# EAGLE design 7SegClock (EAGLE 7.4.0)
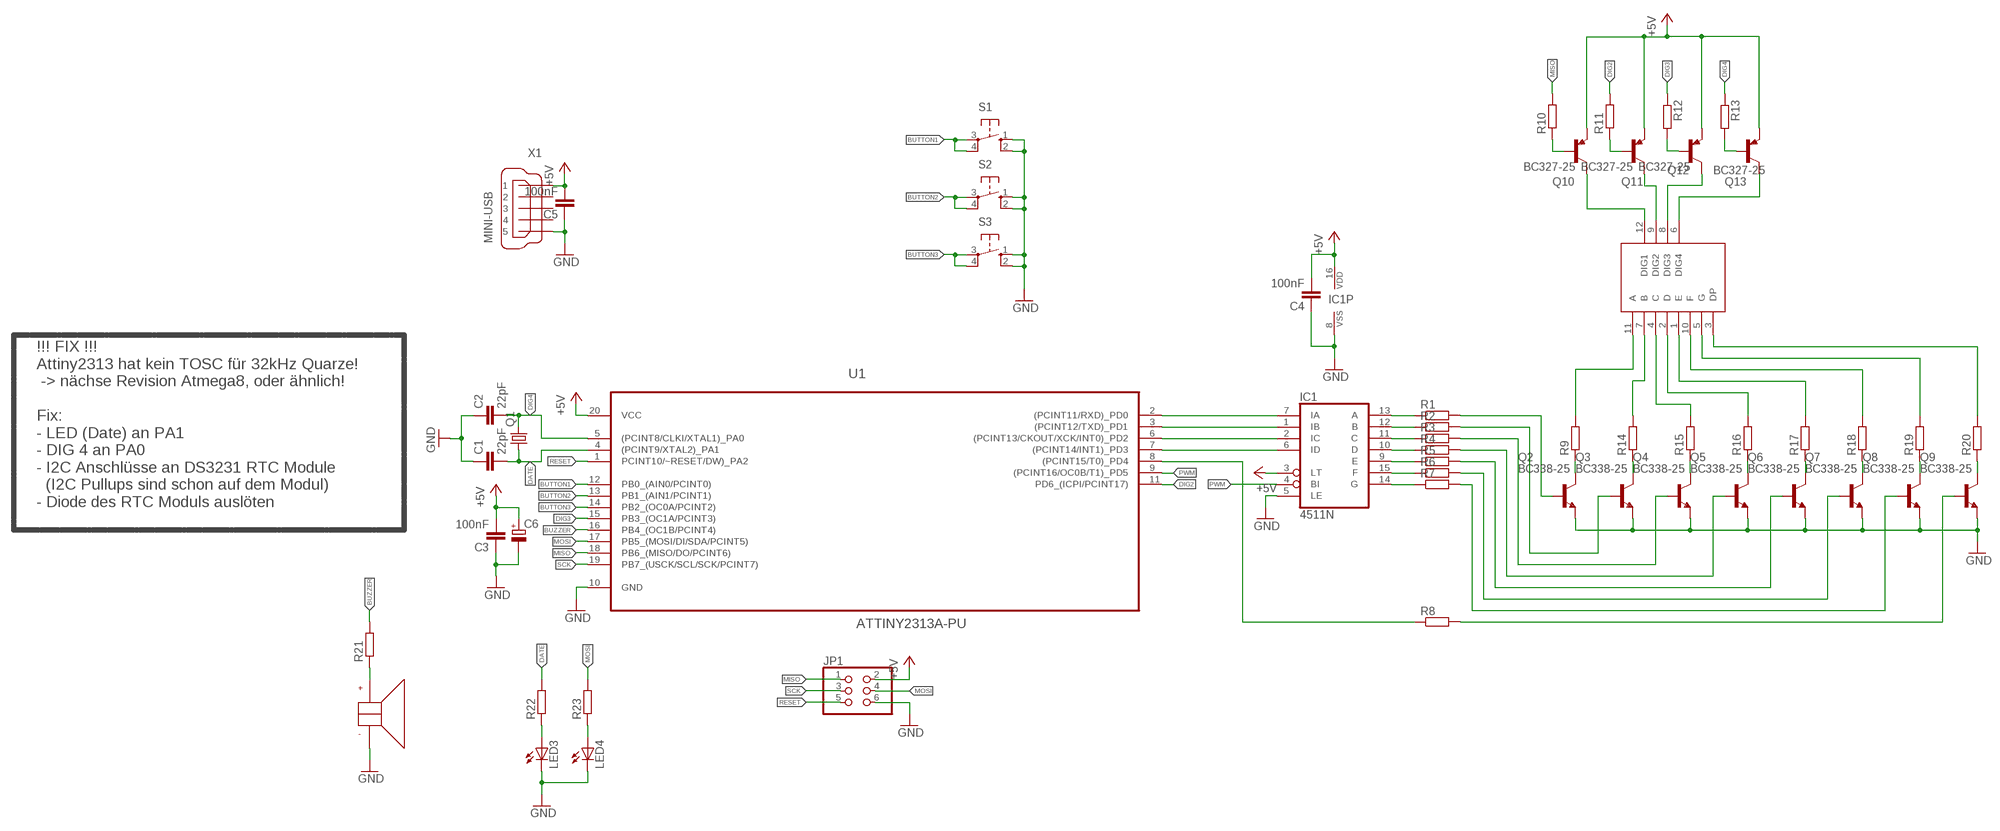
[diagram p0: schematic, sheet 1]

## Parts
C1  22pF  C-EU025-025X050  [C025-025X050]
C2  22pF  C-EU025-025X050  [C025-025X050]
C3  100nF  C-EU025-025X050  [C025-025X050]
C4  100nF  C-EU025-025X050  [C025-025X050]
C5  100nF  C-EU025-025X050  [C025-025X050]
C6  CPOL-EUE2-5  [E2-5]
IC1  4511N  [DIL16]
JP1  PINHD-2X3  [2X03]
LED1  7SEGCOMAN  [7SEGCOMAN]
LED3  LED3MM  [LED3MM]
LED4  LED3MM  [LED3MM]
Q1  CRYSTALTC38H  [TC38H]
Q2  BC338-25  [TO92-EBC]
Q3  BC338-25  [TO92-EBC]
Q4  BC338-25  [TO92-EBC]
Q5  BC338-25  [TO92-EBC]
Q6  BC338-25  [TO92-EBC]
Q7  BC338-25  [TO92-EBC]
Q8  BC338-25  [TO92-EBC]
Q9  BC338-25  [TO92-EBC]
Q10  BC327-25  [TO92-EBC]
Q11  BC327-25  [TO92-EBC]
Q12  BC327-25  [TO92-EBC]
Q13  BC327-25  [TO92-EBC]
R1  R-EU_0207/7  [0207/7]
R2  R-EU_0207/7  [0207/7]
R3  R-EU_0207/7  [0207/7]
R4  R-EU_0207/7  [0207/7]
R5  R-EU_0207/7  [0207/7]
R6  R-EU_0207/7  [0207/7]
R7  R-EU_0207/7  [0207/7]
R8  R-EU_0207/7  [0207/7]
R9  R-EU_0207/7  [0207/7]
R10  R-EU_0207/7  [0207/7]
R11  R-EU_0207/7  [0207/7]
R12  R-EU_0207/7  [0207/7]
R13  R-EU_0207/7  [0207/7]
R14  R-EU_0207/7  [0207/7]
R15  R-EU_0207/7  [0207/7]
R16  R-EU_0207/7  [0207/7]
R17  R-EU_0207/7  [0207/7]
R18  R-EU_0207/7  [0207/7]
R19  R-EU_0207/7  [0207/7]
R20  R-EU_0207/7  [0207/7]
R21  R-EU_0207/7  [0207/7]
R22  R-EU_0207/7  [0207/7]
R23  R-EU_0207/7  [0207/7]
S1  10-XX  [B3F-10XX]
S2  10-XX  [B3F-10XX]
S3  10-XX  [B3F-10XX]
U1  ATTINY2313A-PU  [DIP254P762X533-20]
U$1  PIEZO_BUZZER_RM7,6  [PIEZO_BUZZER_RM7,6]
X1  MINI-USB  MINI-USB-32005-201  [32005-201]

## Nets
+5V: C3.2 C4.2 C5.2 C6.+ IC1.3(LT) IC1.16(VDD) JP1.2 Q10.E Q11.E Q12.E Q13.E U1.20(VCC) X1.1
BUTTON1: S1.3(P) S1.4(P1) U1.12(PB0_(AIN0/PCINT0))
BUTTON2: S2.3(P) S2.4(P1) U1.13(PB1_(AIN1/PCINT1))
BUTTON3: S3.3(P) S3.4(P1) U1.14(PB2_(OC0A/PCINT2))
BUZZER: R21.2 U1.16(PB4_(OC1B/PCINT4))
DATE: C1.2 Q1.1 R22.2 U1.4((PCINT9/XTAL2)_PA1)
DIG2: R11.2 U1.11(PD6_(ICPI/PCINT17))
DIG3: R12.1 U1.15(PB3_(OC1A/PCINT3))
DIG4: C2.2 Q1.2 R13.1 U1.5((PCINT8/CLKI/XTAL1)_PA0)
GND: C1.1 C2.1 C3.1 C4.1 C5.1 C6.- IC1.5(LE) IC1.8(VSS) JP1.6 LED3.K(C) LED4.K(C) Q2.E Q3.E Q4.E Q5.E Q6.E Q7.E Q8.E Q9.E S1.1(S) S1.2(S1) S2.1(S) S2.2(S1) S3.1(S) S3.2(S1) U1.10(GND) U$1.P$2 X1.5
MISO: JP1.1 R10.2 U1.18(PB6_(MISO/DO/PCINT6))
MOSI: JP1.4 R23.2 U1.17(PB5_(MOSI/DI/SDA/PCINT5))
N$3: Q2.B R1.2
N$4: Q3.B R2.2
N$5: Q4.B R3.2
N$6: Q5.B R4.2
N$7: Q6.B R5.2
N$8: Q7.B R6.2
N$9: Q8.B R7.2
N$10: IC1.7(IA) U1.2((PCINT11/RXD)_PD0)
N$11: IC1.1(IB) U1.3((PCINT12/TXD)_PD1)
N$12: IC1.2(IC) U1.6((PCINT13/CKOUT/XCK/INT0)_PD2)
N$13: IC1.6(ID) U1.7((PCINT14/INT1)_PD3)
N$14: Q9.B R8.2
N$15: R8.1 U1.8((PCINT15/T0)_PD4)
N$16: IC1.14(G) R7.1
N$17: IC1.15(F) R6.1
N$18: IC1.9(E) R5.1
N$19: IC1.10(D) R4.1
N$20: IC1.11(C) R3.1
N$21: IC1.12(B) R2.1
N$22: IC1.13(A) R1.1
N$23: LED1.11(A) R9.2
N$24: LED1.7(B) R14.2
N$25: LED1.4(C) R15.2
N$26: LED1.2(D) R16.2
N$27: LED1.1(E) R17.2
N$28: LED1.10(F) R18.2
N$29: LED1.5(G) R19.2
N$30: LED1.3(DP) R20.2
N$32: R21.1 U$1.P$1
N$34: LED3.A R22.1
N$35: LED1.12(DIG1) Q10.C
N$36: LED1.9(DIG2) Q11.C
N$37: LED1.8(DIG3) Q12.C
N$38: LED1.6(DIG4) Q13.C
N$39: Q10.B R10.1
N$40: Q11.B R11.1
N$41: Q12.B R12.2
N$42: Q13.B R13.2
N$43: Q2.C R9.1
N$44: Q3.C R14.1
N$45: Q4.C R15.1
N$46: Q5.C R16.1
N$47: Q6.C R17.1
N$48: Q7.C R18.1
N$49: Q8.C R19.1
N$50: Q9.C R20.1
N$51: LED4.A R23.1
PWM: IC1.4(BI) U1.9((PCINT16/OC0B/T1)_PD5)
RESET: JP1.5 U1.1(PCINT10/~RESET/DW)_PA2)
SCK: JP1.3 U1.19(PB7_(USCK/SCL/SCK/PCINT7))
Unconnected: X1.2 X1.3 X1.4

## Notes on the sheet
- !!! FIX !!!
  Attiny2313 hat kein TOSC für 32kHz Quarze!
   -> nächse Revision Atmega8, oder ähnlich!
  
  Fix:
  - LED (Date) an PA1
  - DIG 4 an PA0
  - I2C Anschlüsse an DS3231 RTC Module 
    (I2C Pullups sind schon auf dem Modul)
  - Diode des RTC Moduls auslöten

## Library data of the parts
C1-C5 = rcl:C-EU: CAPACITOR, European symbol
C6 = rcl:CPOL-EU: POLARIZED CAPACITOR, European symbol
IC1 = 45xx:4511: BCD to 7-segment LATCH/DECODER/DRIVER
JP1 = pinhead:PINHD-2X3: PIN HEADER
LED1 = TM-misc:7SEGCOMAN: 7 Segment Anzeige Common Anode - HDSP-B04E
LED3 LED4 = led:LED: LED OSRAM: - CHIPLED LG R971, LG N971, LY N971, LG Q971, LY Q971, LO R971, LY R971 LH N974, LH R974 LS Q976, LO Q976, LY Q976 LO Q996 - Hyper CHIPLED LW Q18S LB Q993, LB Q99A, LB R99A - SideLED LS A670, LO A670, LY A670, LG A670, LP A670 LB A673, LV A673, LT A673, LW A673 LH A674 LY A675 LS A676, LA A676, LO A676, LY A676, LW A676 LS A679, LY A679, LG A679 - Hyper Micro SIDELED® LS Y876, LA Y876, LO Y876, LY Y876 LT Y87S - SmartLED LW L88C, LW L88S LB L89C, LB L89S, LG L890 LS L89K, LO L89K, LY L89K LS L896, LA L896, LO L896, LY L896 - TOPLED LS T670, LO T670, LY T670, LG T670, LP T670 LSG T670, LSP T670, LSY T670, LOP T670, LYG T670 LG T671, LOG T671, LSG T671 LB T673, LV T673, LT T673, LW T673 LH T674 LS T676, LA T676, LO T676, LY T676, LB T676, LH T676, LSB T676, LW T676 LB T67C, LV T67C, LT T67C, LS T67K, LO T67K, LY T67K, LW E67C LS E67B, LA E67B, LO E67B, LY E67B, LB E67C, LV E67C, LT E67C LW T67C LS T679, LY T679, LG T679 LS T770, LO T770, LY T770, LG T770, LP T770 LB T773, LV T773, LT T773, LW T773 LH T774 LS E675, LA E675, LY E675, LS T675 LS T776, LA T776, LO T776, LY T776, LB T776 LHGB T686 LT T68C, LB T68C - Hyper Mini TOPLED® LB M676 - Mini TOPLED Santana® LG M470 LS M47K, LO M47K, LY M47K Source: http://www.osram.convergy.de LUXEON: - LUMILED® LXK2-PW12-R00, LXK2-PW12-S00, LXK2-PW14-U00, LXK2-PW14-V00 LXK2-PM12-R00, LXK2-PM12-S00, LXK2-PM14-U00 LXK2-PE12-Q00, LXK2-PE12-R00, LXK2-PE12-S00, LXK2-PE14-T00, LXK2-PE14-U00 LXK2-PB12-K00, LXK2-PB12-L00, LXK2-PB12-M00, LXK2-PB14-N00, LXK2-PB14-P00, LXK2-PB14-Q00 LXK2-PR12-L00, LXK2-PR12-M00, LXK2-PR14-Q00, LXK2-PR14-R00 LXK2-PD12-Q00, LXK2-PD12-R00, LXK2-PD12-S00 LXK2-PH12-R00, LXK2-PH12-S00 LXK2-PL12-P00, LXK2-PL12-Q00, LXK2-PL12-R00 Source: www.luxeon.com KINGBRIGHT: KA-3528ASYC Source: www.kingbright.com
Q1 = crystal:CRYSTAL: CRYSTAL; OC_FARNELL: unknown; OC_NEWARK: unknown
Q2-Q9 = transistor-npn:BC338*: NPN Transistor
Q10-Q13 = transistor-pnp:BC327*: PNP Transistror
R1-R23 = rcl:R-EU_: RESISTOR, European symbol
S1-S3 = switch-omron:10-XX: OMRON SWITCH; MPN: B3F-1000; OC_FARNELL: 176432; OC_NEWARK: 36M3542
U1 = AtmelMC:ATTINY2313A-PU: 8-bit Microcontroller; DESCRIPTION: 8-bit Microcontroller; MPN: ATTINY2313A-PU; OC_FARNELL: 1841616; OC_NEWARK: 12T1333; PACKAGE: DIP-20; SUPPLIER: Atmel
U$1 = TM-misc:PIEZO_BUZZER_RM7,6
X1 = con-cypressindustries:MINI-USB-: MINI USB-B Conector Source: www.cypressindustries.com; OC_FARNELL: unknown; OC_NEWARK: unknown

## Board
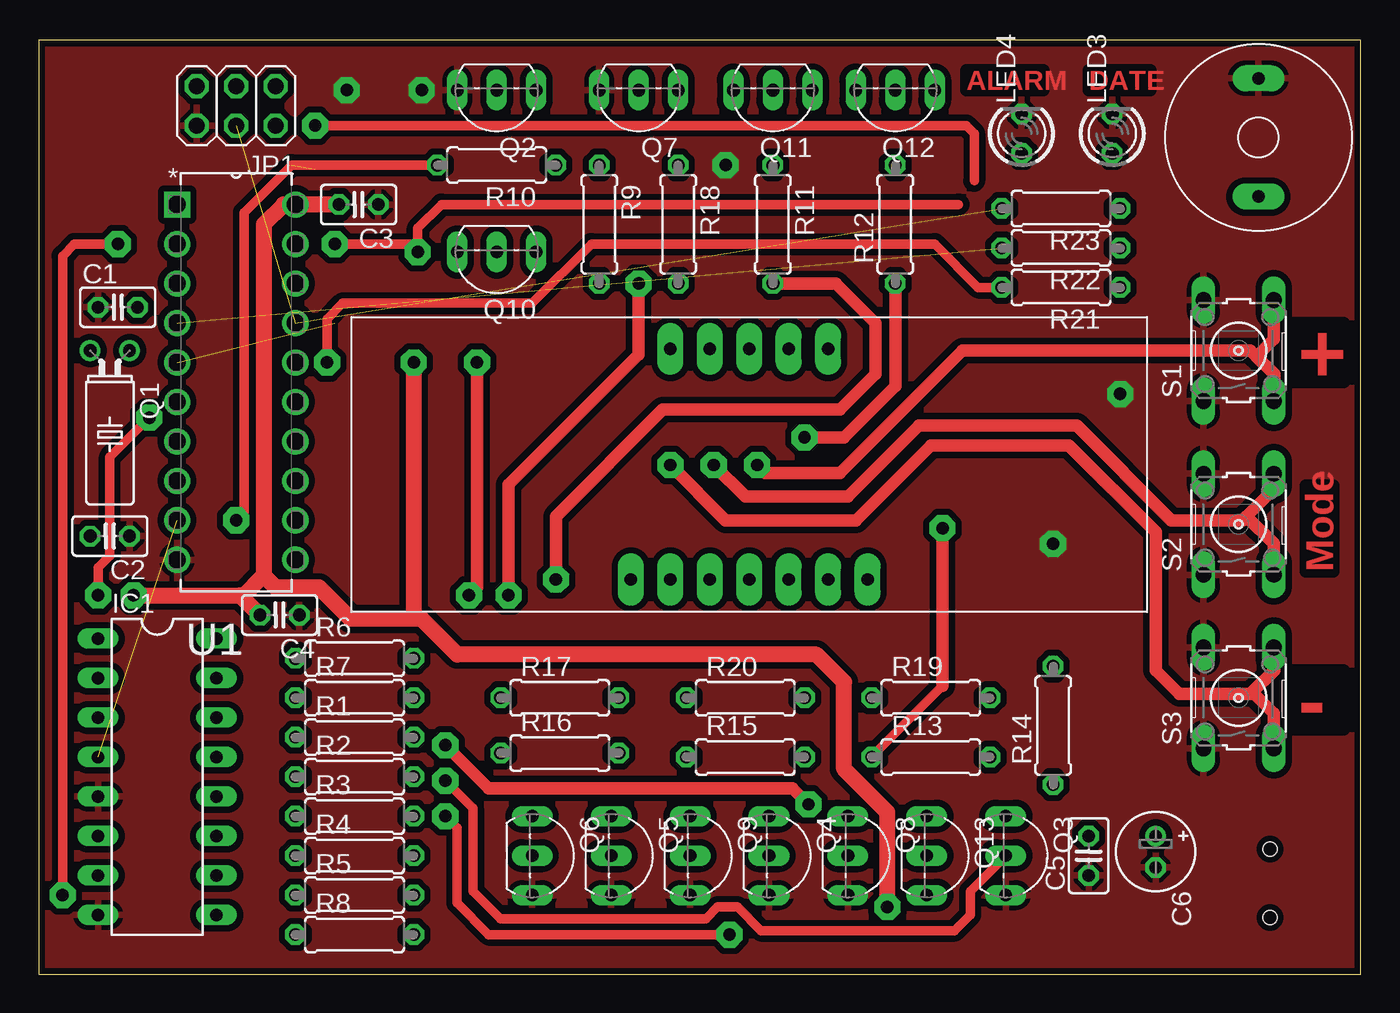
[diagram p1: board, top side]
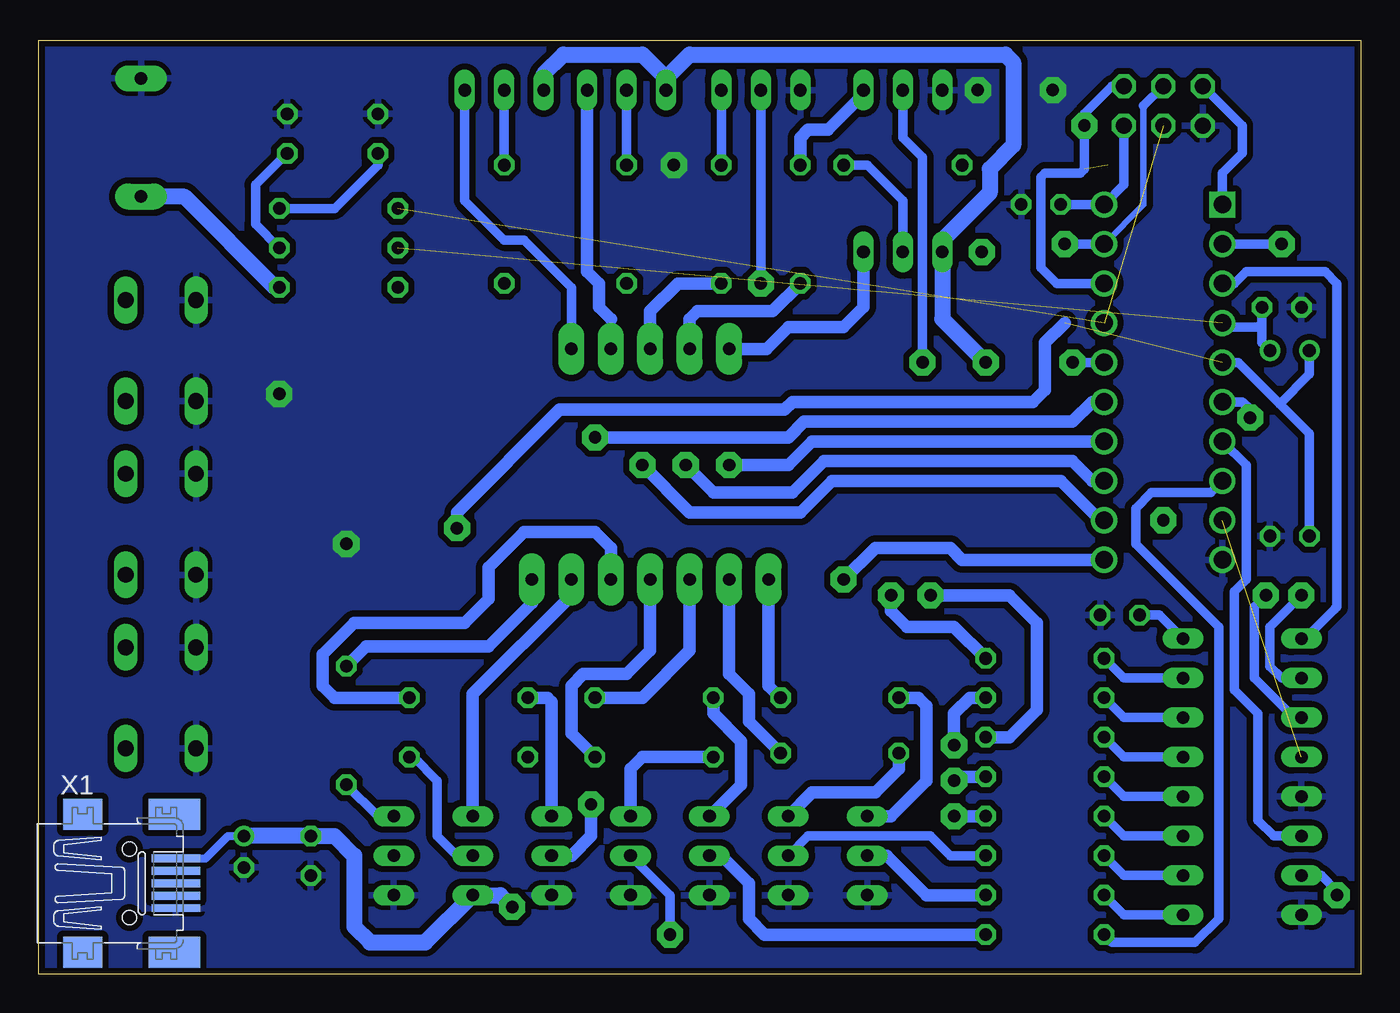
[diagram p2: board, bottom side, seen from below]

Size 85.07 x 60.12 mm. Coordinates in mm from the lower left corner, seen from the top.
Outline: 0,0 85.07,0 85.07,60.12 0,60.12 0,0
Copper layers (1*16): Top 0.035mm / dielectric 1.5mm / Bottom 0.035mm
Design rules "LoetLab": minimum track width 10mil, minimum drill 24mil, track to track 12mil, track to pad 12mil, pad to pad 12mil, via to via 12mil, smd to smd 10mil, copper to edge 12mil, drill to drill 12mil, minimum pad ring 10mil, minimum via ring 10mil, stop-mask expansion 4mil, vias tented up to drill 0mil, thermal gap 12mil

### Footprints (pad centres in the part's own frame; a part is rotated, then mirrored left to right if it is on the bottom)
C025-025X050 = drill 0.813 octagon: 1 -1.27,0; 2 1.27,0
E2-5 = drill 0.813 pad 1.27: + -1.016,0 | drill 0.813 pad 1.27 octagon: - 1.016,0
DIL16 = drill 0.813 long: 1 -8.89,-3.81; 2 -6.35,-3.81; 3 -3.81,-3.81; 4 -1.27,-3.81; 5 1.27,-3.81; 6 3.81,-3.81; 7 6.35,-3.81; 8 8.89,-3.81; 9 8.89,3.81; 10 6.35,3.81; 11 3.81,3.81; 12 1.27,3.81; 13 -1.27,3.81; 14 -3.81,3.81; 15 -6.35,3.81; 16 -8.89,3.81
2X03 = drill 1.016 octagon: 1 -2.54,-1.27; 2 -2.54,1.27; 3 0,-1.27; 4 0,1.27; 5 2.54,-1.27; 6 2.54,1.27
7SEGCOMAN = drill 0.8 pad 1.676 long: 1 -7.62,0; 2 -5.08,0; 3 -2.54,0; 4 0,0; 5 2.54,0; 6 5.08,0; 7 7.62,0; 8 5.08,14.84; 9 2.54,14.84; 10 0,14.84; 11 -2.54,14.84; 12 -5.08,14.84
LED3MM = drill 0.813 octagon: A -1.27,0; K 1.27,0
TC38H = drill 0.813: 1 -1.27,0; 2 1.27,0
TO92-EBC = drill 0.813 long: B 0,-1.27; C -2.54,-1.27; E 2.54,-1.27
0207/7 = drill 0.813 octagon: 1 -3.81,0; 2 3.81,0
B3F-10XX = drill 1.016 long: 1 -3.251,2.261; 2 3.251,2.261; 3 -3.251,-2.261; 4 3.251,-2.261
DIP254P762X533-20 = drill 1.118 square: 1 -7.62,22.86 | drill 1.118: 2 -7.62,20.32; 3 -7.62,17.78; 4 -7.62,15.24; 5 -7.62,12.7; 6 -7.62,10.16; 7 -7.62,7.62; 8 -7.62,5.08; 9 -7.62,2.54; 10 -7.62,0; 11 0,0; 12 0,2.54; 13 0,5.08; 14 0,7.62; 15 0,10.16; 16 0,12.7; 17 0,15.24; 18 0,17.78; 19 0,20.32; 20 0,22.86
PIEZO_BUZZER_RM7,6 = drill 0.8 pad 1.676 long: P$1 -3.8,0; P$2 3.8,0
32005-201 = smd 3.1 x 0.5: 1 3,1.6; 2 3,0.8; 3 3,0; 4 3,-0.8; 5 3,-1.6 | smd 2.5 x 2: M1 -3,-4.45; M2 -3,4.45 | smd 3.3 x 2: M3 2.9,4.45; M4 2.9,-4.45 | hole 0.9: 0,2.2; 0,-2.2

### Placement (x,y rotation side)
C1  5.08,42.93 0 top
C2  4.57,28.19 180 top
C3  20.57,49.53 180 top
C4  15.49,23.11 180 top
C5  67.56,7.62 90 top
C6  71.88,7.87 270 top
IC1  7.62,12.7 270 top
JP1  12.7,55.88 180 top
LED1  45.72,25.4 0 top
LED3  69.09,54.1 90 top
LED4  63.25,54.1 90 top
Q1  4.57,40.13 180 top
Q2  29.46,55.63 180 top
Q3  63.5,7.62 270 top
Q4  48.26,7.62 270 top
Q5  38.1,7.62 270 top
Q6  33.02,7.62 270 top
Q7  38.61,55.63 180 top
Q8  53.34,7.62 270 top
Q9  43.18,7.62 270 top
Q10  29.46,45.21 180 top
Q11  47.24,55.63 180 top
Q12  55.12,55.63 180 top
Q13  58.42,7.62 270 top
R1  20.32,15.24 0 top
R2  20.32,12.7 0 top
R3  20.32,10.16 0 top
R4  20.32,7.62 0 top
R5  20.32,5.08 0 top
R6  20.32,20.32 0 top
R7  20.32,17.78 0 top
R8  20.32,2.54 0 top
R9  36.07,48.26 270 top
R10  29.46,52.07 180 top
R11  47.24,48.26 270 top
R12  55.12,48.26 90 top
R13  57.4,13.97 0 top
R14  65.28,16 90 top
R15  45.47,13.97 0 top
R16  33.53,14.22 0 top
R17  33.53,17.78 0 top
R18  41.15,48.26 270 top
R19  57.4,17.78 0 top
R20  45.47,17.78 0 top
R21  65.79,44.2 180 top
R22  65.79,46.74 180 top
R23  65.79,49.28 180 top
S1  77.22,40.13 90 top
S2  77.22,28.96 90 top
S3  77.22,17.78 90 top
U1  16.51,26.67 0 top
U$1  78.49,53.85 90 top
X1  79.25,5.84 0 bottom

### Tracks (layer width: path | path; a pad name or v marks a point on that pad's centre or on a via)
+5V  (via drill 0.8 pad 1.68)
  Top 0.61: 12.95,24.38 13.08,24.26
  Top 1.016: v6.1,24.38 12.95,24.38 | C4.2 13.08,24.26 14.48,25.65 | C3.2 15.75,49.53 14.48,48.26 14.48,25.65 | v54.61,4.32 54.61,10.41 51.82,13.21 51.82,18.8 50.04,20.57 26.92,20.57 24.64,22.86 23.88,22.86 | 23.88,22.86 20.07,22.86 18.03,24.89 15.24,24.89 14.48,25.65 | v24.13,39.37 24.13,23.11 23.88,22.86
  Bottom 0.508: X1.1 74.35,7.44 72.9,8.89 C6.+
  Bottom 0.61: JP1.2 15.24,50.8 U1.20 C3.2 | C4.2 12.95,23.11 IC1.16 | IC1.3 4.32,16.51 6.86,19.05 6.86,23.62 v6.1,24.38 | Q11.E 44.7,57.66
  Bottom 1.016: v54.61,4.32 55.37,5.08 Q13.E 60.2,2.03 63.75,2.03 64.77,3.05 64.77,7.62 66.04,8.89 C5.2 C6.+ | Q12.E 52.58,57.91 51.31,59.18 46.23,59.18 44.7,57.66 43.18,59.18 22.86,59.18 22.35,58.67 22.35,53.34 23.88,51.82 23.88,50.29 26.92,47.24 Q10.E 26.92,42.16 v24.13,39.37
BUTTON1  (via drill 0.8 pad 1.68)
  Top 0.61: v46.23,32.77 46.74,32.26
  Top 0.813: 46.74,32.26 51.56,32.26 59.44,40.13 77.98,40.13 78.36,39.75 | 78.36,39.75 79.5,38.61 79.5,36.91 S1.3 | S1.4 79.48,40.87 78.36,39.75
  Bottom 0.813: U1.12 16.76,29.21 19.3,31.75 34.04,31.75 36.07,29.72 43.18,29.72 v46.23,32.77
BUTTON2  (via drill 0.8 pad 1.68)
  Top 0.813: v43.43,32.77 45.47,30.73 52.07,30.73 56.64,35.31 66.8,35.31 72.9,29.21 77.47,29.21 77.72,29.46 | 77.72,29.46 79.5,31.24 79.5,32.18 S2.4 | S2.3 79.48,27.71 77.72,29.46
  Bottom 0.813: U1.13 17.27,31.75 18.54,33.02 34.54,33.02 36.58,30.99 41.66,30.99 v43.43,32.77
BUTTON3  (via drill 0.8 pad 1.68)
  Top 0.813: v40.64,32.77 44.2,29.21 52.58,29.21 57.4,34.04 66.29,34.04 71.88,28.45 71.88,19.56 73.41,18.03 77.98,18.03 78.11,18.16 | 78.11,18.16 79.5,19.56 79.5,21.01 S3.4 | S3.3 79.48,16.79 78.11,18.16
  Bottom 0.813: U1.14 35.31,34.29 36.83,32.77 v40.64,32.77
BUZZER  (via drill 0.8 pad 1.68)
  Top 0.61: v18.54,39.37 18.54,42.16 19.56,43.18 31.75,43.18 35.56,46.99 57.66,46.99 60.45,44.2 R21.2
  Bottom 0.61: U1.16 v18.54,39.37
DATE  (1 unrouted)
  Bottom 0.61: U1.4 8.64,41.66 6.6,41.66 6.35,41.91 | C1.2 6.35,41.91 | 6.35,41.91 6.35,40.64 Q1.1
DIG2  (via drill 0.8 pad 1.68)
  Top 0.813: v33.27,25.4 33.27,29.46 40.13,36.32 51.56,36.32 53.85,38.61 53.85,41.91 51.31,44.45 R11.2
  Bottom 0.813: U1.11 25.65,26.67 26.42,27.43 31.24,27.43 v33.27,25.4
DIG3  (via drill 0.8 pad 1.68)
  Top 0.813: v49.28,34.54 51.82,34.54 55.12,37.85 R12.1
  Bottom 0.813: U1.15 17.27,36.83 18.54,35.56 35.81,35.56 36.83,34.54 v49.28,34.54
DIG4  (via drill 0.8 pad 1.68)  (1 unrouted)
  Top 0.61: 58.17,18.54 R13.1
  Top 0.813: v58.17,28.7 58.17,18.54
  Bottom 0.61: Q1.2 3.3,38.61 5.21,36.7 | C2.2 3.3,34.8 5.21,36.7 | U1.5 7.87,39.37 5.21,36.7
  Bottom 0.813: 19.05,41.91 20.32,40.64 20.32,37.59 21.08,36.83 36.58,36.83 37.08,36.32 51.56,36.32 58.17,29.72 v58.17,28.7
GND  (via drill 0.8 pad 1.68)
  other vias: 24.64,56.9 19.81,56.9 44.2,52.07 69.6,37.34 65.28,27.69
  pour Bottom (isolate 0.406): 0,0 85.09,0 85.09,60.96 0,60.96
  pour Top (isolate 0.406): 0,0 85.09,0 85.09,60.96 0,60.96
MISO  (via drill 0.8 pad 1.68)  (1 unrouted)
  Top 0.61: v17.78,54.61 59.69,54.61 60.2,54.1 60.2,51.05 | v12.7,29.21 13.21,29.72 13.21,49.02 16.26,52.07 R10.2
  Bottom 0.61: JP1.1 16,57.15 17.78,55.37 v17.78,54.61 17.78,51.82 18.03,51.56 20.32,51.56 20.57,51.31 20.57,45.47 19.56,44.45 U1.18
MOSI  (2 unrouted)
N$3  (via drill 0.8 pad 1.68)
  Top 0.813: v28.19,39.37 28.19,24.89 v27.69,24.38
  Bottom 0.61: Q2.B 29.46,53.85 28.19,52.58 v28.19,39.37
  Bottom 0.813: v27.69,24.38 22.61,24.38 20.83,22.61 20.83,17.02 22.61,15.24 R1.2
N$4  (via drill 0.8 pad 1.68)
  Top 0.61: v26.16,12.45 27.94,10.67 27.94,5.33 29.72,3.56 42.93,3.56 43.69,4.32 44.96,4.32 46.48,2.79 58.93,2.79 59.94,3.81 59.94,5.33 Q3.B
  Bottom 0.813: R2.2 25.91,12.7 v26.16,12.45
N$5  (via drill 0.8 pad 1.68)
  Top 0.61: v26.16,10.16 26.92,9.4 26.92,4.57 28.96,2.54 v44.45,2.54
  Bottom 0.61: v44.45,2.54 44.45,5.08 Q4.B
  Bottom 0.813: R3.2 v26.16,10.16
N$6
  Bottom 0.61: R4.2 26.42,7.62 27.69,8.89 35.56,8.89 Q5.B
N$7
  Bottom 0.813: R5.2 27.94,5.08 30.48,7.62 Q6.B
N$8  (via drill 0.8 pad 1.68)
  Top 0.813: v38.61,44.45 38.61,39.88 30.23,31.5 v30.23,24.38
  Bottom 0.61: Q7.B v38.61,44.45
  Bottom 0.813: v30.23,24.38 30.23,23.37 29.21,22.35 26.16,22.35 R6.2
N$9  (via drill 0.8 pad 1.68)
  Top 0.813: v26.16,14.73 28.96,11.94 48.51,11.94 v49.53,10.92
  Bottom 0.813: R7.2 25.15,17.78 26.16,16.76 v26.16,14.73 | v49.53,10.92 49.53,8.89 50.8,7.62 Q8.B
N$10  (via drill 0.8 pad 1.68)
  Top 0.61: v5.08,46.99 2.29,46.99 1.52,46.23 v1.52,5.08
  Bottom 0.61: U1.2 v5.08,46.99 | v1.52,5.08 1.52,5.33 2.54,6.35 IC1.7
N$11
  Bottom 0.61: IC1.1 3.56,21.59 1.65,23.5 1.52,23.62 1.52,44.45 2.29,45.21 7.37,45.21 8.13,44.45 U1.3
N$12  (via drill 0.8 pad 1.68)
  Top 0.61: v3.81,24.38 3.81,26.16 4.57,26.92 4.57,33.27 v7.11,35.81
  Bottom 0.61: IC1.2 5.08,19.05 5.84,19.81 5.84,22.35 v3.81,24.38 | v7.11,35.81 7.11,36.32 7.62,36.83 U1.6
N$13
  Bottom 0.61: IC1.6 5.59,8.89 6.6,9.91 6.6,16.76 8.13,18.29 8.13,24.64 7.37,25.4 7.37,32.77 U1.7
N$14
  Bottom 0.813: R8.2 38.35,2.54 39.37,3.56 39.37,5.84 41.15,7.62 Q9.B
N$15
  Bottom 0.61: R8.1 16,2.03 10.67,2.03 9.14,3.56 9.14,22.35 14.48,27.69 14.48,29.97 13.46,30.99 9.65,30.99 U1.8
N$16
  Bottom 0.61: IC1.14 15.24,16.51 R7.1
N$17
  Bottom 0.61: IC1.15 15.24,19.05 R6.1
N$18
  Bottom 0.61: IC1.9 15.24,3.81 R5.1
N$19
  Bottom 0.61: IC1.10 15.24,6.35 R4.1
N$20
  Bottom 0.61: IC1.11 15.24,8.89 R3.1
N$21
  Bottom 0.61: IC1.12 15.24,11.43 R2.1
N$22
  Bottom 0.61: IC1.13 15.24,13.97 R1.1
N$23
  Bottom 0.813: R9.2 37.85,42.67 42.67,42.67 43.18,42.16 LED1.11
N$24
  Bottom 0.813: LED1.7 53.34,23.88 56.13,21.08 64.01,21.08 R14.2
N$25
  Bottom 0.813: LED1.4 45.72,20.83 47.24,19.3 50.04,19.3 50.8,18.54 50.8,15.49 R15.2
N$26
  Bottom 0.813: LED1.2 40.64,19.3 39.37,18.03 39.37,16.26 R16.2
N$27
  Bottom 0.813: LED1.1 38.1,18.54 R17.2
N$28
  Bottom 0.813: R18.2 43.94,44.45 45.72,42.67 LED1.10
N$29
  Bottom 0.813: LED1.5 48.26,27.43 49.28,28.45 53.85,28.45 56.13,26.16 56.13,24.13 57.66,22.61 64.77,22.61 66.8,20.57 66.8,18.54 66.04,17.78 R19.2
N$30
  Bottom 0.813: LED1.3 43.18,20.83 46.23,17.78 R20.2
N$32
  Bottom 1.016: R21.1 69.85,44.2 75.69,50.04 78.48,50.04 U$1.P$1
N$34
  Bottom 0.61: LED3.A 71.12,50.8 71.12,48.26 R22.1
N$35
  Bottom 0.813: LED1.12 38.25,40.24 36.83,41.66 33.27,41.66 32,42.93 Q10.C
N$36
  Bottom 0.61: 48.26,42.16 LED1.9
  Bottom 0.813: Q11.C 49.78,45.21 49.02,44.45 49.02,42.93 48.26,42.16
N$37
  Bottom 0.61: Q12.C 57.66,49.78 55.12,47.24 53.85,47.24 50.8,44.2 LED1.8
N$38
  Bottom 0.813: Q13.C 57.15,18.03 50.8,24.38 LED1.6
N$39
  Bottom 0.61: R10.1 31.75,52.07 29.46,49.78 Q10.B
N$40
  Bottom 0.61: Q11.B R11.1
N$41
  Bottom 0.61: Q12.B R12.2
N$42
  Bottom 0.61: Q13.B 58.17,7.62 59.44,8.89 59.44,12.45 60.96,13.97 R13.2
N$43
  Bottom 0.813: Q2.C 32,56.64 34.29,54.36 35.56,54.36 36.07,53.85 R9.1
N$44
  Bottom 0.61: Q3.C 63.25,10.16 R14.1
N$45
  Bottom 0.813: R15.1 46.23,13.97 46.99,13.21 Q4.C
N$46
  Bottom 0.813: R16.1 29.72,13.21 31.24,11.68 35.31,11.68 Q5.C
N$47
  Bottom 0.813: R17.1 28.45,17.78 27.94,17.27 27.94,12.45 30.23,10.16 Q6.C
N$48
  Bottom 0.61: Q7.C R18.1
N$49
  Bottom 0.813: R19.1 52.32,17.78 52.07,17.53 Q8.C
N$50
  Bottom 0.813: R20.1 41.66,16.76 39.88,14.99 39.88,12.19 Q9.C
N$51
  Bottom 0.61: R23.1 66.04,49.28 63.25,52.07 LED4.A
PWM  (1 unrouted)
RESET
  Bottom 0.61: U1.1 8.89,51.56 7.62,52.83 7.62,54.61 JP1.5
SCK  (via drill 0.8 pad 1.68)
  Top 0.61: 59.18,49.53 25.91,49.53 24.38,48.01 v24.38,46.48 23.88,46.99 v19.05,46.99
  Bottom 0.406: 13.97,55.88 13.97,49.53 U1.19
  Bottom 0.61: JP1.3 13.97,55.88 | U1.19 v19.05,46.99

### Text on the board
Top: ALARM | DATE | + | Mode | -